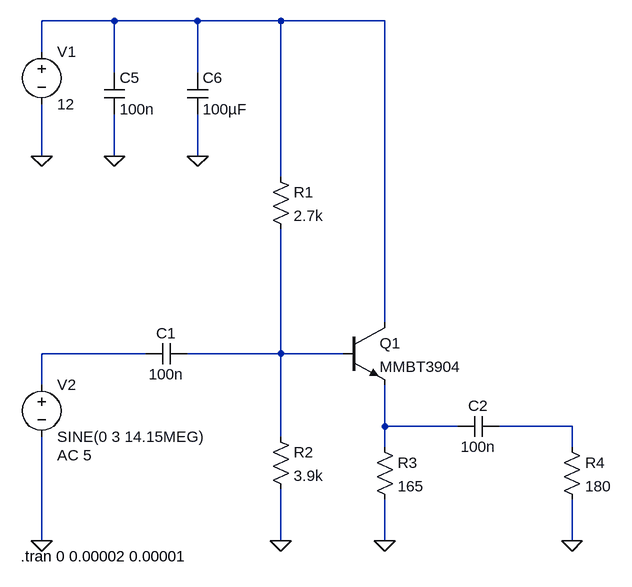
[diagram p0: schematic Buffer Amplifier.asc]
Buffer Amplifier.asc, the LTspice schematic file:
Version 4
SHEET 1 3796 680
WIRE -224 -352 -336 -352
WIRE -96 -352 -224 -352
WIRE 32 -352 -96 -352
WIRE 192 -352 32 -352
WIRE -336 -304 -336 -352
WIRE -224 -272 -224 -352
WIRE -96 -272 -96 -352
WIRE -336 -144 -336 -224
WIRE -224 -144 -224 -208
WIRE -96 -144 -96 -208
WIRE 32 -112 32 -352
WIRE 192 112 192 -352
WIRE -176 160 -336 160
WIRE 32 160 32 -32
WIRE 32 160 -112 160
WIRE 128 160 32 160
WIRE -336 208 -336 160
WIRE 192 272 192 208
WIRE 304 272 192 272
WIRE 480 272 368 272
WIRE 32 288 32 160
WIRE 192 304 192 272
WIRE 480 304 480 272
WIRE -336 448 -336 288
WIRE 32 448 32 368
WIRE 192 448 192 384
WIRE 480 448 480 384
FLAG -336 448 0
FLAG 192 448 0
FLAG 32 448 0
FLAG -336 -144 0
FLAG -224 -144 0
FLAG -96 -144 0
FLAG 480 448 0
SYMBOL npn 128 112 R0
SYMATTR InstName Q1
SYMATTR Value MMBT3904
SYMBOL voltage -336 -320 R0
WINDOW 123 0 0 Left 2
WINDOW 39 0 0 Left 2
SYMATTR InstName V1
SYMATTR Value 12
SYMBOL voltage -336 192 R0
WINDOW 123 24 124 Left 2
WINDOW 39 0 0 Left 2
SYMATTR Value2 AC 5
SYMATTR InstName V2
SYMATTR Value SINE(0 3 14.15MEG)
SYMBOL cap -112 144 R90
WINDOW 0 0 32 VBottom 2
WINDOW 3 32 32 VTop 2
SYMATTR InstName C1
SYMATTR Value 100n
SYMBOL cap -240 -272 R0
SYMATTR InstName C5
SYMATTR Value 100n
SYMBOL cap -112 -272 R0
SYMATTR InstName C6
SYMATTR Value 100µF
SYMBOL res 16 -128 R0
SYMATTR InstName R1
SYMATTR Value 2.7k
SYMBOL res 16 272 R0
SYMATTR InstName R2
SYMATTR Value 3.9k
SYMBOL res 176 288 R0
SYMATTR InstName R3
SYMATTR Value 165
SYMBOL res 464 288 R0
SYMATTR InstName R4
SYMATTR Value 180
SYMBOL cap 368 256 R90
WINDOW 0 0 32 VBottom 2
WINDOW 3 32 32 VTop 2
SYMATTR InstName C2
SYMATTR Value 100n
TEXT -368 472 Left 2 !.tran 0 0.00002 0.00001

The netlist it stands for:
* Buffer Amplifier.asc
Q1 N001 N003 N004 0 MMBT3904
V1 N001 0 12
V2 N002 0 SINE(0 3 14.15MEG) AC 5
C1 N003 N002 100n
C5 N001 0 100n
C6 N001 0 100µF
R1 N001 N003 2.7k
R2 N003 0 3.9k
R3 N004 0 165
R4 N005 0 180
C2 N005 N004 100n
.model NPN NPN
.model PNP PNP
.lib standard.bjt
.tran 0 0.00002 0.00001
.backanno
.end